# Altium schematic sheet 传感器模块+液晶.SchDoc
size A4
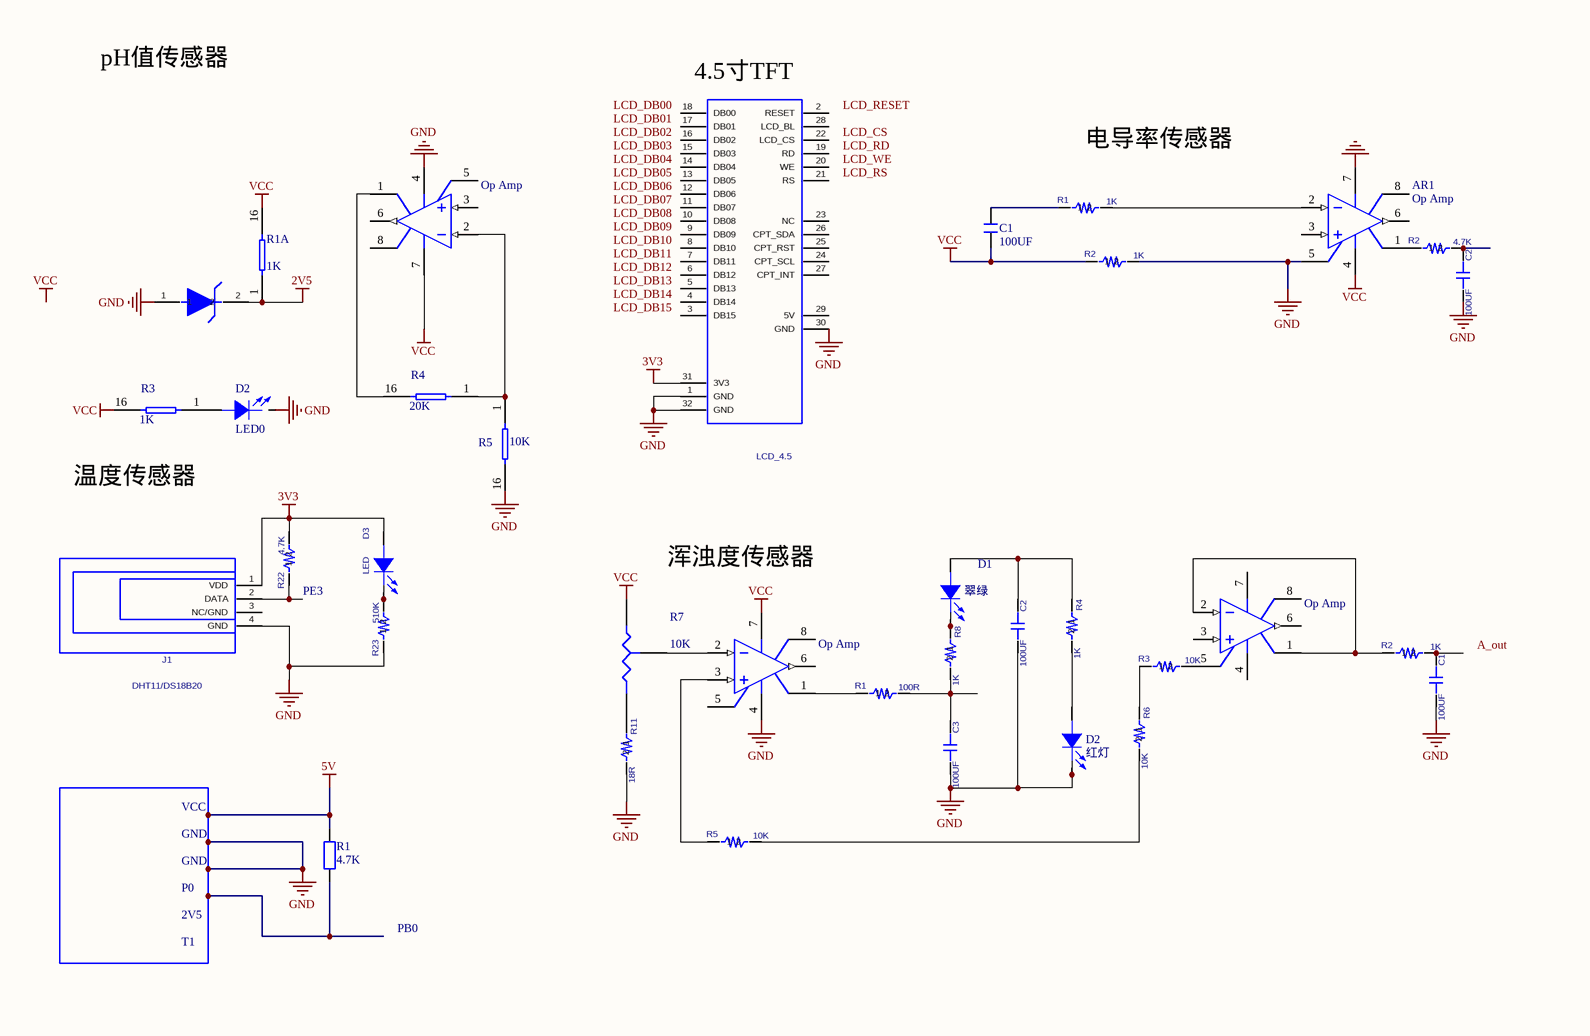
[diagram p0: 传感器模块+液晶.SchDoc]

## Parts
(Parts that share a designator on the sheet are numbered #1, #2 ... from top to bottom, then left to right.)
?#1  value 20K  [DIP-16]  (hidden comment: Res Pack2)  (part A of 8)
?#2  value 1K  [DIP-16]  (hidden comment: Res Pack2)  (part A of 8)
?#3  value 10K  [DIP-16]  (hidden comment: Res Pack2)  (part A of 8)
AR1  Op Amp  [H-08A]
AR?#1  Op Amp  [H-08A]
AR?#2  Op Amp  [H-08A]
AR?#3  Op Amp  [H-08A]
C1#1  100UF  [C 0402]
C1#2  value 100UF  [C_0603]  (hidden comment: C_1UF_0603)
C2#1  value 100UF  [C_0603]  (hidden comment: C_1UF_0603)
C2#2  value 100UF  [C_0603]  (hidden comment: C_1UF_0603)
C3  value 100UF  [C_0603]  (hidden comment: C_1UF_0603)
D3  value LED  [LED_0603]  (hidden comment: LED_RED_0603)
D?#1  ZMM5V1  [DIODE_SOP]  (value not drawn)
D?#2  LED_RED_0603  [LED_0603]  (value not drawn)
D?#3  LED_RED_0603  [LED_0603]  (value not drawn)
D?#4  LED_RED_0603  [LED_0603]  (value not drawn)
J1  DHT11/DS18B20  [HDR1X4]
J?  LCD_4.5  [2X16X2.54MM]
R1#1  value 1K  [R_0603]  (hidden comment: R_68R_0603)
R1#2  value 1K  [DIP-16]  (hidden comment: Res Pack2)  (part A of 8)
R1#3  value 100R  [R_0603]  (hidden comment: R_68R_0603)
R1#4  4.7K  [R 0402]
R2#1  value 4.7K  [R_0603]  (hidden comment: R_68R_0603)
R2#2  value 1K  [R_0603]  (hidden comment: R_68R_0603)
R2#3  value 1K  [R_0603]  (hidden comment: R_68R_0603)
R3  value 10K  [R_0603]  (hidden comment: R_68R_0603)
R4  value 1K  [R_0603]  (hidden comment: R_68R_0603)
R5  value 10K  [R_0603]  (hidden comment: R_68R_0603)
R6  value 10K  [R_0603]  (hidden comment: R_68R_0603)
R7  value 10K  [VR3]  (hidden comment: Res Tap)
R8  value 1K  [R_0603]  (hidden comment: R_68R_0603)
R11  value 18R  [R_0603]  (hidden comment: R_68R_0603)
R22  value 4.7K  [R_0603]  (hidden comment: R_1K_0603)
R23  value 510K  [R_0603]  (hidden comment: R_1K_0603)

## Nets
2V5: D?#1.2 R1#2.1
3V3: D3.A(ANODE) J1.1(VDD) J?.31(3V3) R22.2
5V: ?#3.16 AR1.5(OS_NUL) AR?#1.4(V-) AR?#3.4(V-) C1#2.2 C2#1.2 C2#2.2 C3.2 D?#1.1 D?#2.K(CATHODE) D?#4.K(CATHODE) J1.4(GND) J?.1(GND) J?.30(GND) J?.32(GND) R1#4.1 R1#4.2 R2#2.2 R11.2 R23.1  [also labelled GND]
VCC: ?#2.16 AR1.4(V-) AR?#1.7(V+) AR?#3.7(V+) C1#1.1 R1#2.16 R2#2.1 R7.1(A)
Net?#1_1: ?#1.1 ?#3.1 AR?#1.2(IN-)
Net?#1_16: ?#1.16 AR?#1.1(OS_NUL)
Net?#2_1: ?#2.1 D?#2.A(ANODE)
NetAR1_1: AR1.1(OS_NUL) R2#1.1
NetAR1_2: AR1.2(IN-) R1#1.2
NetAR?#2_1: AR?#2.1(OS_NUL) AR?#2.2(IN-) R2#3.1
NetAR?#2_5: AR?#2.5(OS_NUL) R3.2
NetAR?#3_1: AR?#3.1(OS_NUL) R1#3.1
NetAR?#3_2: AR?#3.2(IN-) R7.3(TAP)
NetAR?#3_3: AR?#3.3(IN+) R5.1
NetC1#1_2: C1#1.2 R1#1.1
NetC1#2_1: C1#2.1 R2#3.2
NetC2#1_1: C2#1.1 R2#1.2
NetC2#2_1: C2#2.1 D?#3.A(ANODE) R4.1
NetC3_1: C3.1 R1#3.2 R8.2
NetD3_K: D3.K(CATHODE) R23.2
NetD?#3_K: D?#3.K(CATHODE) R8.1
NetD?#4_A: D?#4.A(ANODE) R4.2
NetJ1_2: J1.2(DATA) R22.1
NetR3_1: R3.1 R6.1
NetR5_2: R5.2 R6.2
NetR7_2: R7.2(B) R11.1

Not connected (* = marked no-connect by the designer): AR1 3(IN+) 6(OUT) 7(V+) 8(TAB); AR?#1 3(IN+) 5(OS_NUL) 6(OUT) 8(TAB); AR?#2 3(IN+) 4(V-) 6(OUT) 7(V+) 8(TAB); AR?#3 5(OS_NUL) 6(OUT) 8(TAB); J1 3(NC/GND); J? 2(RESET) 3(DB15) 4(DB14) 5(DB13) 6(DB12) 7(DB11) 8(DB10) 9(DB09) 10(DB08) 11(DB07) 12(DB06) 13(DB05) 14(DB04) 15(DB03) 16(DB02) 17(DB01) 18(DB00) 19(RD) 20(WE) 21(RS) 22(LCD_CS) 23(NC) 24(CPT_SCL) 25(CPT_RST) 26(CPT_SDA) 27(CPT_INT) 28(LCD_BL) 29(5V)

## Notes on the sheet
- pH值传感器
- (near J?) 4.5寸TFT
- 电导率传感器
- (near ?#1) R4
- R3
- (near D?#2) D2
- (near D?#2) LED0
- (near ?#3) R5
- 温度传感器
- 浑浊度传感器
- (near D?#3) D1
- (near R22) PE3
- (near D?#3) 翠绿
- (near D?#4) D2
- (near D?#4) 红灯
- VCC
- GND
- P0
- 2V5
- T1
- PB0
- Labels drawn without touching a wire or pin: A_out, LCD_CS, LCD_DB00, LCD_DB01, LCD_DB02, LCD_DB03, LCD_DB04, LCD_DB05, LCD_DB06, LCD_DB07, LCD_DB08, LCD_DB09, LCD_DB10, LCD_DB11, LCD_DB12, LCD_DB13, LCD_DB14, LCD_DB15, LCD_RD, LCD_RESET, LCD_RS, LCD_WE, VCC

## Library data of the parts
?#1-?#3 R1#2 = Res Pack2: Isolated Resistor Network - Parts; Sim Note: Enter the Resistance value into parameter field.; Published: 24-Mar-1999; LatestRevisionDate: 17-Jul-2002; LatestRevisionNote: Re-released for DXP Platform.; PackageReference: DIP-16; Publisher: Altium Limited; Code_JEDEC: MO-001-AC
AR1 AR?#1-AR?#3 = Op Amp: FET Operational Amplifier; Published: 8-Jun-2000; LatestRevisionDate: 17-Jul-2002; LatestRevisionNote: Re-released for DXP Platform.; DatasheetVersion: REV. B; PackageVersion: 1990; PackageReference: H-08A; Publisher: Altium Limited; PackageDescription: Can; 8 Leads; Pin Circle Dia. 5.08 mm; Lead Dia. 0.53 mm (max); ComponentLink1Description: Manufacturer Link; ComponentLink1URL: http://www.analog.com/
C1#1 = C: 无极性贴片电容; 版权归属: 源创客; 材质: X7R; BOM名称: 无极性贴片电容; 学习资源: www.ooocke.com
J1 = DHT11/DS18B20: Manufacture 1 P/N: DHT11/DS1302; PCB DECAL: HDR1X4
J? = LCD_4.5: Value: 2X26PINX2.54MM; PCB DECAL: 2X16X2.54MM
R1#4 = R: 贴片电阻; 版权归属: 源创客; BOM名称: 贴片电阻; 学习资源: www.ooocke.com
R7 = Res Tap: Tapped Resistor; Sim Note: Enter the Resistance value and the set point into parameter fields.; Set Position: 0.5; Published: 24-Mar-1999; LatestRevisionDate: 17-Jul-2002; LatestRevisionNote: Re-released for DXP Platform.; PackageReference: VR3; Publisher: Altium Limited; PackageDescription: Variable Resistor, Thru-Hole; 3 Leads
C1#2 C2#1 C2#2 C3 = C_1UF_0603: PCB DECAL: C_0603
D3 D?#2-D?#4 = LED_RED_0603: PCB DECAL: LED_0603
D?#1 = ZMM5V1: Value: ZMM5V1; PCB DECAL: DIODE_SOP
R1#1 R1#3 R2#1-R2#3 R3-R6 R8 R11 = R_68R_0603: PCB DECAL: R_0603
R22 R23 = R_1K_0603: PCB DECAL: R_0603